# Altium schematic sheet SCHEMATIC_ESP32C3FN4_8thJune2023.SchDoc
size B
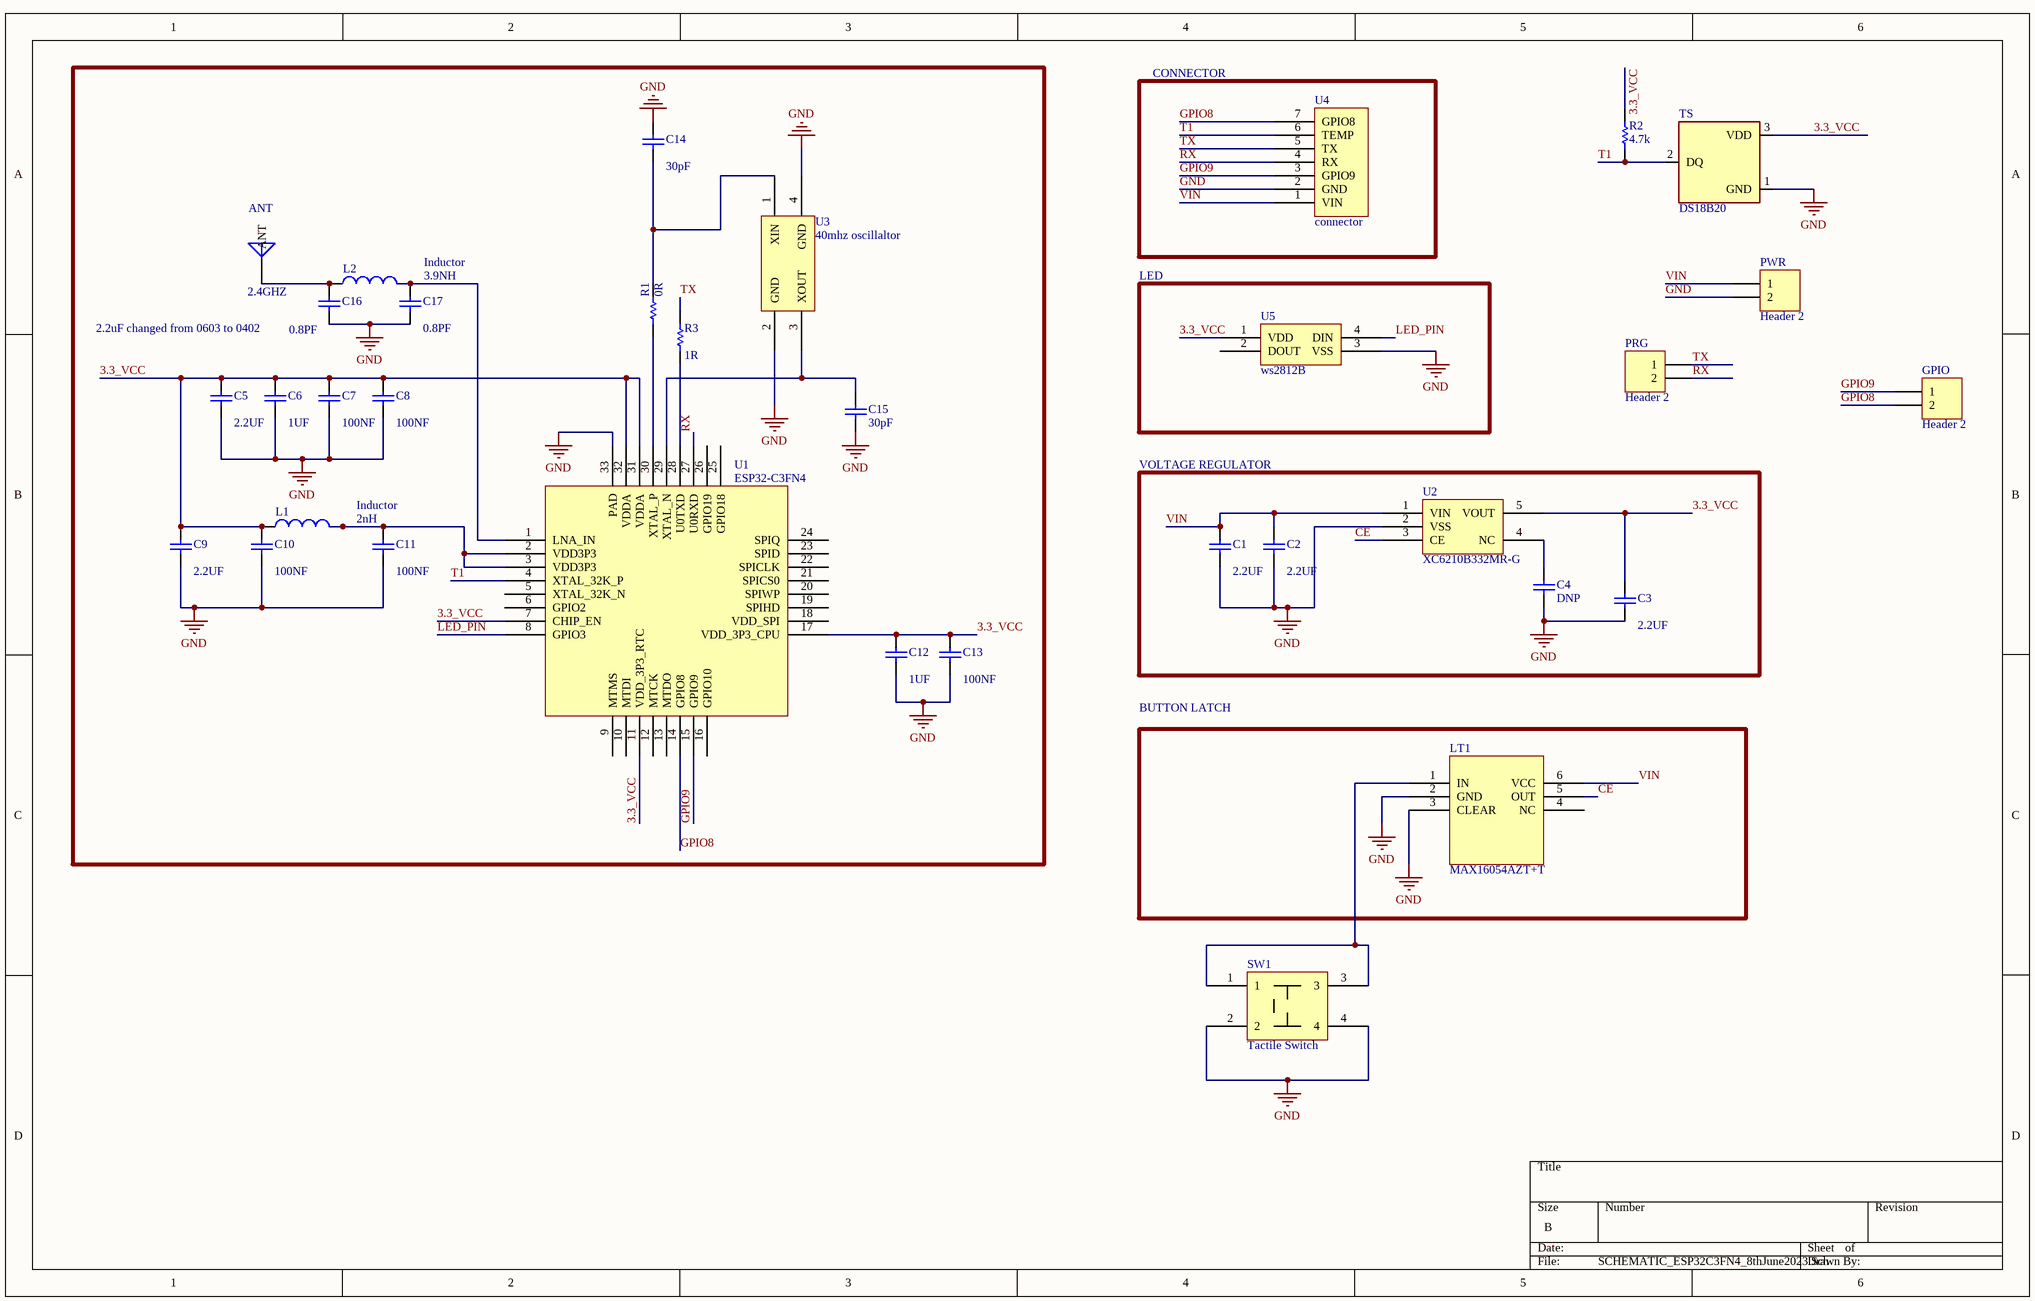
[diagram p0: SCHEMATIC_ESP32C3FN4_8thJune2023.SchDoc]

## Parts
ANT  2.4GHZ  [XDCR_2450AT18B100E]
C1  value 2.2UF  [0402-A]  (hidden comment: GRM188C71C225KE11D)
C2  value 2.2UF  [0402-A]  (hidden comment: GRM188C71C225KE11D)
C3  value 2.2UF  [0402-A]  (hidden comment: GRM188C71C225KE11D)
C4  DNP  [0402]
C5  value 2.2UF  [0402-A]  (hidden comment: GRM188C71C225KE11D)
C6  value 1UF  [0402-A]  (hidden comment: Cap)
C7  value 100NF  [0402-A]  (hidden comment: Cap)
C8  value 100NF  [0402-A]  (hidden comment: Cap)
C9  value 2.2UF  [0402-A]  (hidden comment: GRM188C71C225KE11D)
C10  value 100NF  [0402-A]  (hidden comment: Cap)
C11  value 100NF  [0402-A]  (hidden comment: Cap)
C12  value 1UF  [0402-A]  (hidden comment: Cap)
C13  value 100NF  [0402-A]  (hidden comment: Cap)
C14  value 30pF  [1608[0603]]  (hidden comment: Cap)
C15  value 30pF  [1608[0603]]  (hidden comment: Cap)
C16  value 0.8PF  [0402-A]  (hidden comment: Cap)
C17  value 0.8PF  [0402-A]  (hidden comment: Cap)
GPIO  Header 2  [C1206]
L1  Inductor  value 2nH  [1608[0603]]
L2  Inductor  value 3.9NH  [0402-A]
LT1  MAX16054AZT+T  [SOT95P275X110-6N]
PRG  Header 2  [C1206]
PWR  Header 2  [C1206]
R1  value 0R  [0402-A]  (hidden comment: Res1)
R2  value 4.7k  [1608[0603]]  (hidden comment: SCR0603J4K7)
R3  value 1R  [0402-A]  (hidden comment: Res1)
SW1  Tactile Switch  [SKRBACE010]
TS  DS18B20  [TO-92-TO92127P495H2044-3]
U1  ESP32-C3FN4  [QFN50P500X500X90-33N-D]
U2  XC6210B332MR-G  [SOT95P280X130-5N]
U3  40mhz oscillaltor  [CRYSTAL-SMD_4P-L3.2-W2.5-BL]
U4  connector  (graphical)
U5  ws2812B  [COM16346]

## Blocks framed on the sheet
2.2uF changed from 0603 to 0402: ANT C5-C17 L1 L2 R1 R3 U1 U3
CONNECTOR: U4
LED: U5
VOLTAGE REGULATOR: C1-C4 U2
BUTTON LATCH: LT1

## Nets
GND: C1.1 C2.1 C3.1 C4.1 C5.1 C6.1 C7.1 C8.1 C9.1 C10.1 C11.1 C12.1 C13.1 C14.2 C15.2 C16.1 C17.1 LT1.2(GND) LT1.3(CLEAR) PWR.2 SW1.2 SW1.4 TS.1(GND) U1.33(PAD) U2.2(VSS) U3.2(GND) U3.4(GND) U4.2(GND) U5.3(VSS)
3.3_VCC: C3.2 C5.2 C6.2 C7.2 C8.2 C9.2 C10.2 C12.2 C13.2 L1.1 R2.1 TS.3(VDD) U1.7(CHIP_EN) U1.11(VDD_3P3_RTC) U1.17(VDD_3P3_CPU) U1.31(VDDA) U1.32(VDDA) U2.5(VOUT) U5.1(VDD)
CE: LT1.5(OUT) U2.3(CE)
GPIO8: GPIO.2 U1.14(GPIO8) U4.7(GPIO8)
GPIO9: GPIO.1 U1.15(GPIO9) U4.3(GPIO9)
LED_PIN: U1.8(GPIO3) U5.4(DIN)
RX: PRG.2 U1.27(U0RXD) U4.4(RX)
T1: R2.2 TS.2(DQ) U1.4(XTAL_32K_P) U4.6(TEMP)
TX: PRG.1 R3.1 U4.5(TX)
VIN: C1.2 C2.2 LT1.6(VCC) PWR.1 U2.1(VIN) U4.1(VIN)
NetANT_1: ANT.1(ANT) C16.2 L2.1
NetC4_2: C4.2 U2.4(NC)
NetC11_2: C11.2 L1.2 U1.2(VDD3P3) U1.3(VDD3P3)
NetC14_1: C14.1 R1.1 U3.1(XIN)
NetC15_1: C15.1 U1.29(XTAL_N) U3.3(XOUT)
NetC17_2: C17.2 L2.2 U1.1(LNA_IN)
NetLT1_1: LT1.1(IN) SW1.1 SW1.3
NetR1_2: R1.2 U1.30(XTAL_P)
NetR3_2: R3.2 U1.28(U0TXD)

Not connected (* = marked no-connect by the designer): LT1 4(NC); U1 5(XTAL_32K_N) 6(GPIO2) 9(MTMS) 10(MTDI) 12(MTCK) 13(MTDO) 16(GPIO10) 18(VDD_SPI) 19(SPIHD) 20(SPIWP) 21(SPICS0) 22(SPICLK) 23(SPID) 24(SPIQ) 25(GPIO18) 26(GPIO19); U5 2(DOUT)

## Library data of the parts
ANT = Antenna: Generic Antennals; Published: 24-Mar-1999; LatestRevisionDate: 17-Jul-2002; LatestRevisionNote: Re-released for DXP Platform.; PackageReference: PIN1; Publisher: Altium Limited; ComponentLink1Description: Antenna digi key; ComponentLink1URL: https://www.digikey.com/en/products/detail/johanson-technology-inc/2450AT18B100E/1560677; ComponentLink2Description: LCSC; ComponentLink2URL: https://www.lcsc.com/product-detail/Antennas_Johanson-Dielectrics-2450AT18B100E_C2917717.html; ComponentLink3Description: C2917717; ComponentLink3URL: C2917717
C1-C3 C5 C9 = Cap: 16V 2.2uF X6S ±10% 0402 Multilayer Ceramic Capacitors MLCC - SMD/SMT ROHS; Published: 8-Jun-2000; LatestRevisionDate: 17-Jul-2002; LatestRevisionNote: Re-released for DXP Platform.; PackageReference: RAD-0.3; Publisher: Altium Limited; PackageDescription: Radial Cap, Thru-Hole; 2 Leads; 0.3 in Pin Spacing; LCSC: C437523
C4 = Cap: Capacitor; Value: 100pF; Published: 8-Jun-2000; LatestRevisionDate: 17-Jul-2002; LatestRevisionNote: Re-released for DXP Platform.; PackageReference: RAD-0.3; Publisher: Altium Limited; PackageDescription: Radial Cap, Thru-Hole; 2 Leads; 0.3 in Pin Spacing; LCSC: DNP
C6 C12 = Cap: 35V 1uF ±10% 0402 Multilayer Ceramic Capacitors MLCC - SMD/SMT ROHS; Published: 8-Jun-2000; LatestRevisionDate: 17-Jul-2002; LatestRevisionNote: Re-released for DXP Platform.; PackageReference: RAD-0.3; Publisher: Altium Limited; PackageDescription: Radial Cap, Thru-Hole; 2 Leads; 0.3 in Pin Spacing; LCSC: C968773
C7 C8 C10 C11 C13 = Cap: 50V 100nF X7R ±10% 0402 Multilayer Ceramic Capacitors MLCC - SMD/SMT ROHS; Published: 8-Jun-2000; LatestRevisionDate: 17-Jul-2002; LatestRevisionNote: Re-released for DXP Platform.; PackageReference: RAD-0.3; Publisher: Altium Limited; PackageDescription: Radial Cap, Thru-Hole; 2 Leads; 0.3 in Pin Spacing; LCSC: C131394
C14-C17 = Cap: Capacitor; Published: 8-Jun-2000; LatestRevisionDate: 17-Jul-2002; LatestRevisionNote: Re-released for DXP Platform.; PackageReference: RAD-0.3; Publisher: Altium Limited; PackageDescription: Radial Cap, Thru-Hole; 2 Leads; 0.3 in Pin Spacing
  C14 C15: LCSC: C1658
  C17: LCSC: C76915
GPIO PRG PWR = Header 2: Header, 2-Pin; LatestRevisionDate: 17-Jul-2002; LatestRevisionNote: Re-released for DXP Platform.; Publisher: Altium Limited; LCSC: DNP
L1 L2 = Inductor: Code_IEC: 1005; Published: 8-Jun-2000; LatestRevisionDate: 29-May-2009; LatestRevisionNote: IPC-7351 Footprint Added.; PackageReference: 0402-A; Publisher: Altium Limited; PackageDescription: Chip Inductor; Code_JEITA: 0402
  L1: LCSC: C395081
  L2: LCSC: C285959
R1 = Res1: 62.5mW Thick Film Resistors ±800ppm/℃ ±1% 0Ω 0402 Chip Resistor - Surface Mount ROHS; Published: 8-Jun-2000; LatestRevisionDate: 17-Jul-2002; LatestRevisionNote: Re-released for DXP Platform.; PackageReference: AXIAL-0.3; Publisher: Altium Limited; PackageDescription: Axial Device, Thru-Hole; 2 Leads; 0.3 in Pin Spacing; LCSC: C17168
R2 = Res1: ±5% 4.7kΩ 0603 Chip Resistor - Surface Mount ROHS; Published: 8-Jun-2000; LatestRevisionDate: 17-Jul-2002; LatestRevisionNote: Re-released for DXP Platform.; PackageReference: AXIAL-0.3; Publisher: Altium Limited; PackageDescription: Axial Device, Thru-Hole; 2 Leads; 0.3 in Pin Spacing; LCSC: C3017722
R3 = Res1: 62.5mW Thick Film Resistors ±1% ±200ppm/℃ 1Ω 0402 Chip Resistor - Surface Mount ROHS; Published: 8-Jun-2000; LatestRevisionDate: 17-Jul-2002; LatestRevisionNote: Re-released for DXP Platform.; PackageReference: AXIAL-0.3; Publisher: Altium Limited; PackageDescription: Axial Device, Thru-Hole; 2 Leads; 0.3 in Pin Spacing; LCSC: C25086
TS = DS18B20: Temperature Sensor Digital, Local -55Â°C ~ 125Â°C 12 b TO-92-3; MF: Maxim Integrated; Package: TO-92 Maxim Integrated; Value: *; Price: None; MP: DS18B20; Availability: Unavailable; SnapEDA_Link: https://www.snapeda.com/parts/DS18B20/Maxim%20Integrated/view-part/1266091/?ref=snap; LCSC: DNP
U1 = ESP32-C3F: LCSC: C5143572
U2 = XC6210B332MR-G: 700mA 60dB@(1kHz) Fixed 3.3V~3.3V Positive 6V SOT-25 Linear Voltage Regulators (LDO) ROHS; LCSC: C47719
U3 = 40mhz oscillaltor: C3003278; LCSC: C3003278
U5 = ws2812B: RGB SMD5050 Light Emitting Diodes (LED) ROHS; LCSC: C114586
LT1 = MAX16054AZT+T: LCSC: C79401
SW1 = Tactile Switch: LCSC: C139789